# Altium schematic sheet 30.SchDoc
size 513 x 386 mm
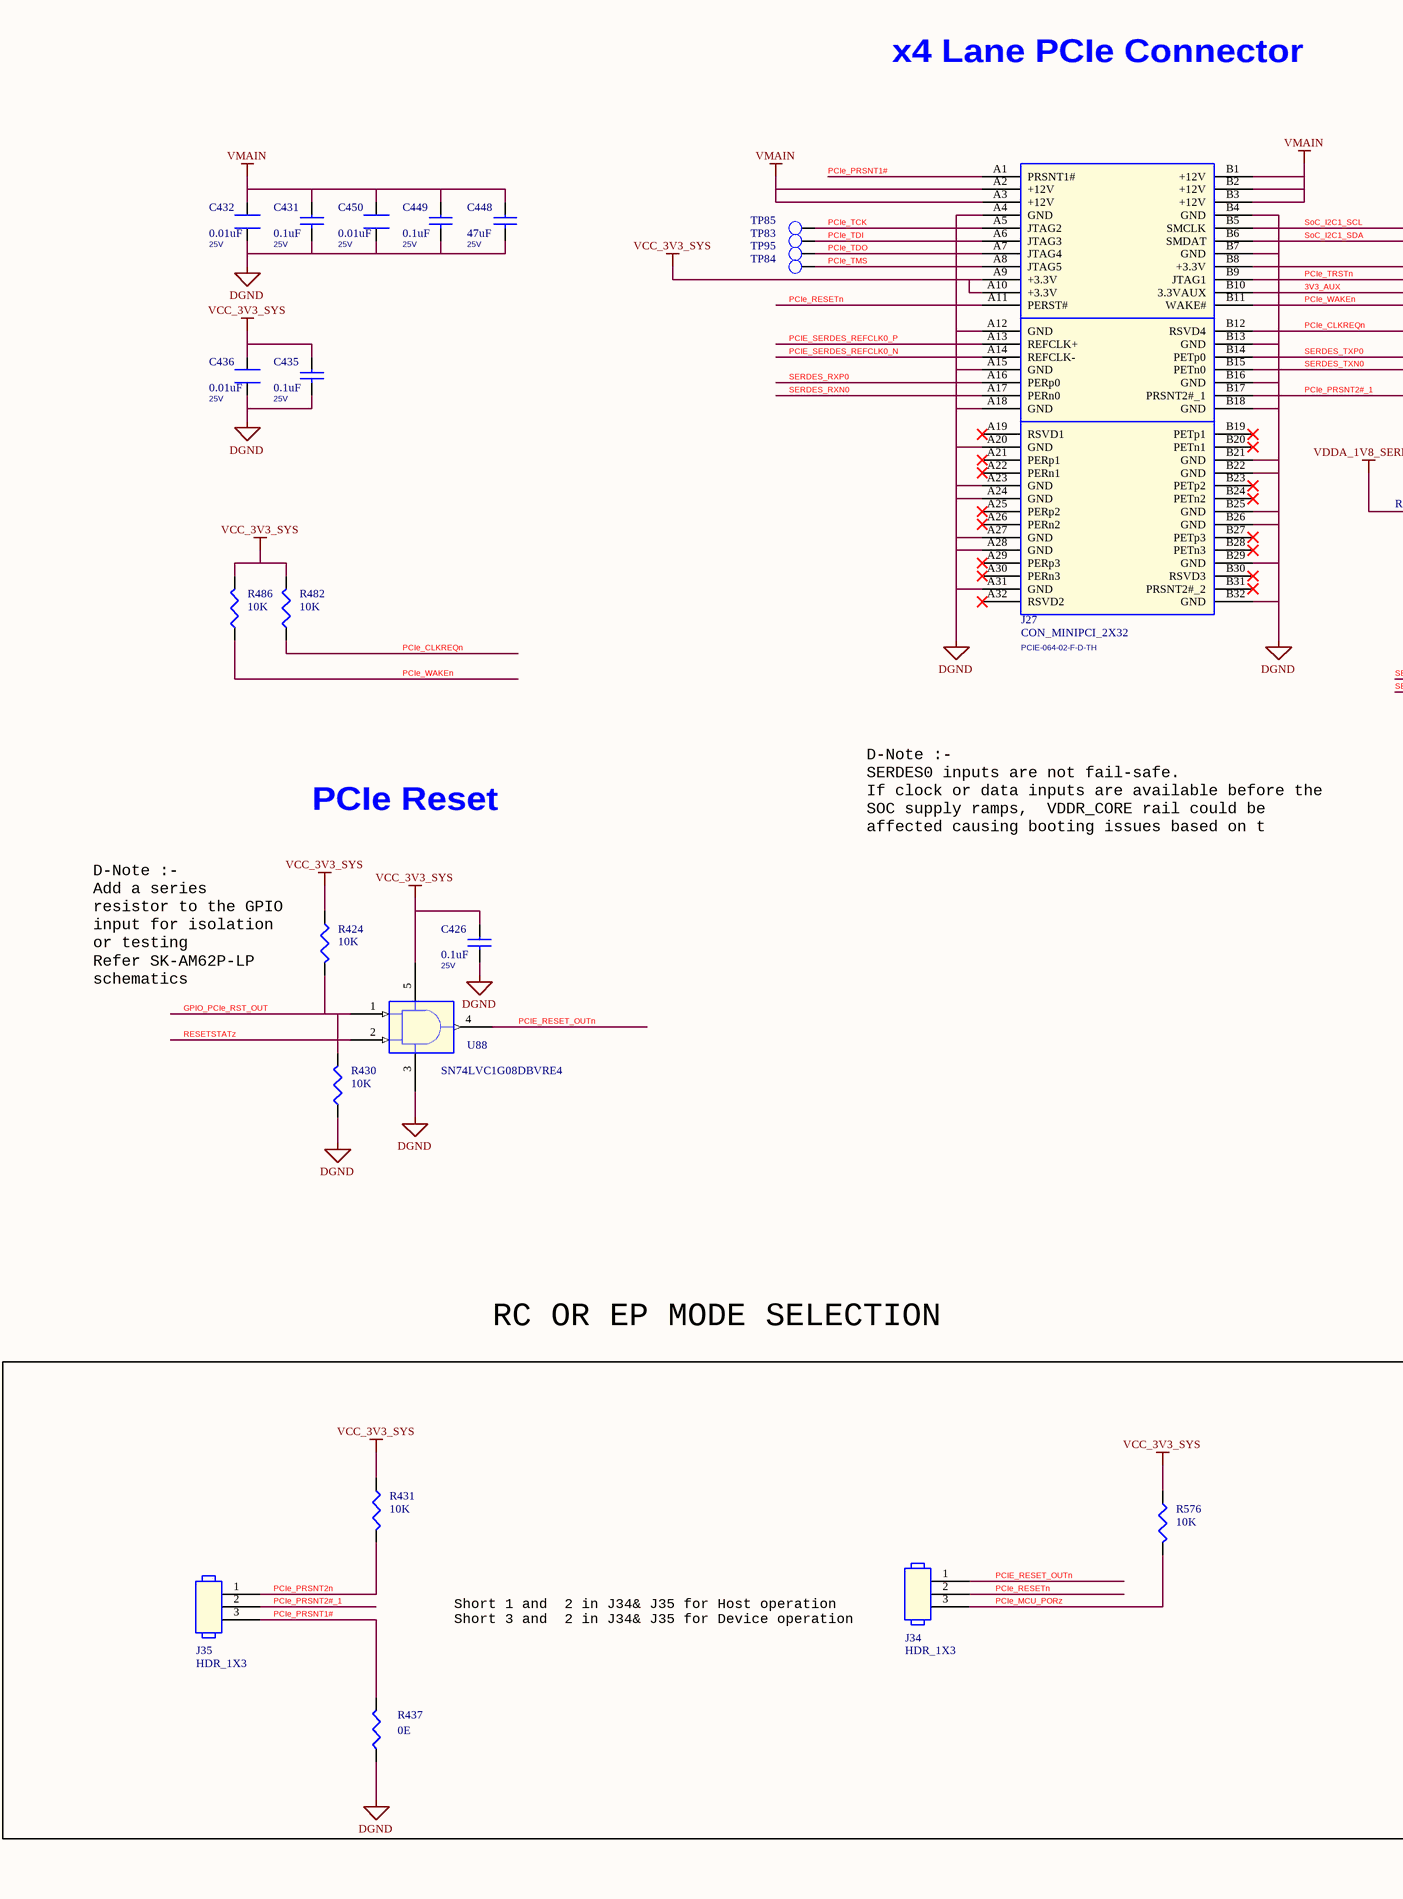
[diagram p0: 30.SchDoc, left]
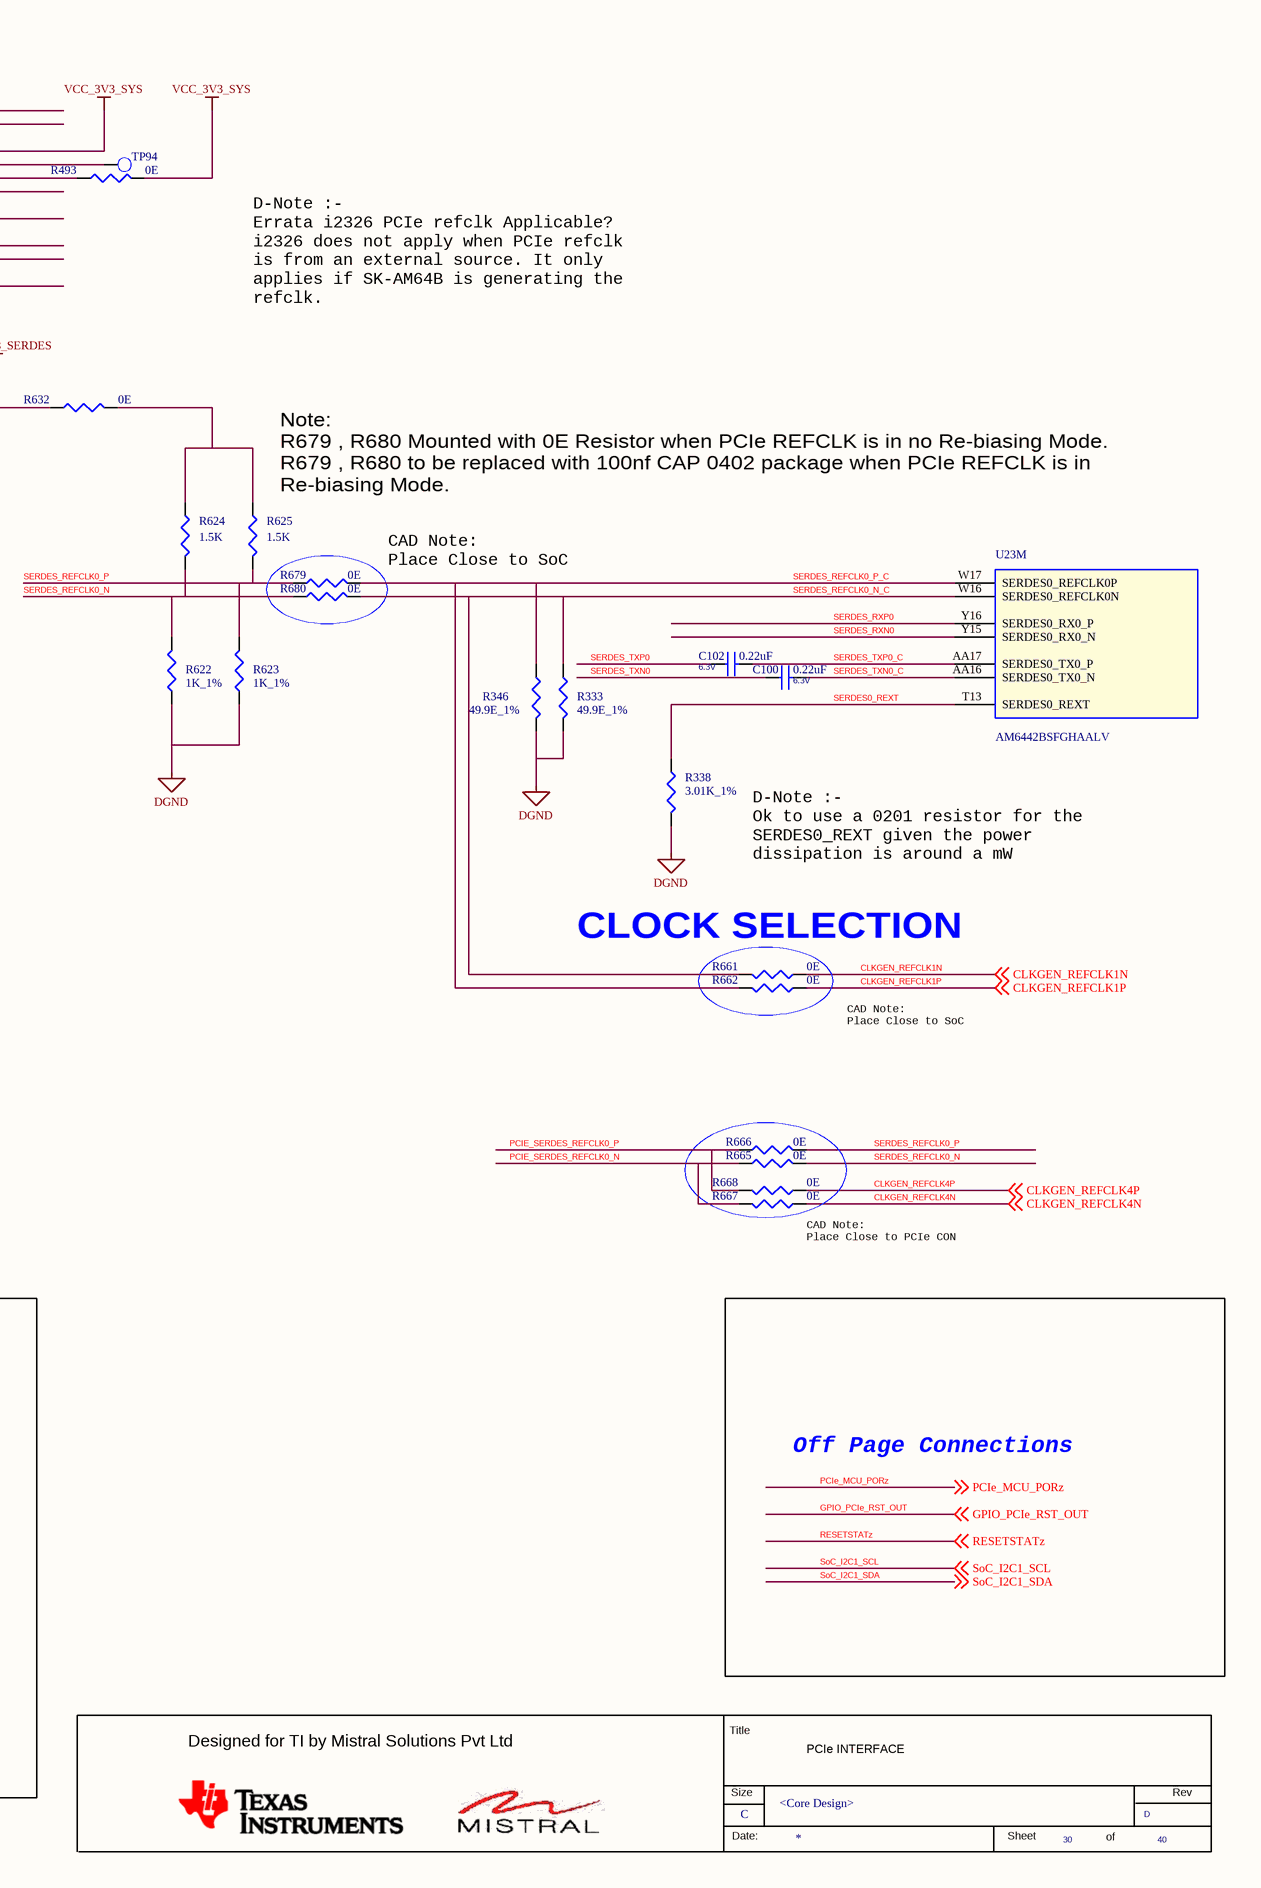
[diagram p1: 30.SchDoc, right]

## Parts
*  RevCode: D  Title: PCIe INTERFACE  Page Size: C  Page Number: 30  Page Count: 40  Variant Name: <Core Design>  (hidden comment: MISTRAL_TITLEBLK_CSIZE)  (graphical)
C100  0.22uF  Voltage: 6.3V  [CAP0201_0-5]
C102  0.22uF  Voltage: 6.3V  [CAP0201_0-5]
C426  0.1uF  Voltage: 25V  [CAP0402_0-75]
C431  0.1uF  Voltage: 25V  [CAP0402_0-75]
C432  0.01uF  Voltage: 25V  [CAP0402N]
C435  0.1uF  Voltage: 25V  [CAP0402_0-75]
C436  0.01uF  Voltage: 25V  [CAP0402N]
C448  47uF  Voltage: 25V  [CAP1206_2]
C449  0.1uF  Voltage: 25V  [CAP0402_0-75]
C450  0.01uF  Voltage: 25V  [CAP0402N]
J27  CON_MINIPCI_2X32  Mfr_part_number: PCIE-064-02-F-D-TH  [CON_MINIPCI2X32_PCIE-064-02_S_S_T_11]
J34  HDR_1X3  [HDR_3X1_100_S_T]
J35  HDR_1X3  [HDR_3X1_100_S_T]
R333  49.9E_1%  [RES0402_0-5]
R338  3.01K_1%  [RES0402_0-5]
R346  49.9E_1%  [RES0402_0-5]
R424  10K  [RES0402_0-5]
R430  10K  [RES0402_0-5]
R431  10K  [RES0402_0-5]
R437  0E  [RES0402_0-5]
R482  10K  [RES0402_0-5]
R486  10K  [RES0402_0-5]
R493  0E  [RES0402_0-5]
R576  10K  [RES0402_0-5]
R622  1K_1%  [RES0402_0-5]
R623  1K_1%  [RES0402_0-5]
R624  1.5K  [RES0402_0-5]
R625  1.5K  [RES0402_0-5]
R632  0E  [RES0402_0-5]
R661  0E  [RES0402_0-5]
R662  0E  [RES0402_0-5]
R665  0E  [RES0402_0-5]
R666  0E  [RES0402_0-5]
R667  0E  [RES0402_0-5]
R668  0E  [RES0402_0-5]
R679  0E  [RES0402_0-5]
R680  0E  [RES0402_0-5]
TP83  TP20_SMD  [TP20_SMD]  (value not drawn)
TP84  TP20_SMD  [TP20_SMD]  (value not drawn)
TP85  TP20_SMD  [TP20_SMD]  (value not drawn)
TP94  TP20_SMD  [TP20_SMD]  (value not drawn)
TP95  TP20_SMD  [TP20_SMD]  (value not drawn)
U23  AM6442BSFGHAALV  [FCBGA441_31-49_680X680_2-6]  (part M of 16)
U88  SN74LVC1G08DBVRE4  [SOT23-5]

## Nets
DGND: C426.2 C431.2 C432.2 C435.2 C436.2 C448.2 C449.2 C450.2 J27.A4(GND) J27.A12(GND) J27.A15(GND) J27.A18(GND) J27.A20(GND) J27.A23(GND) J27.A24(GND) J27.A27(GND) J27.A28(GND) J27.A31(GND) J27.B4(GND) J27.B7(GND) J27.B13(GND) J27.B16(GND) J27.B18(GND) J27.B21(GND) J27.B22(GND) J27.B25(GND) J27.B26(GND) J27.B29(GND) J27.B32(GND) R333.2 R338.2 R346.2 R430.2 R437.1 R622.1 R623.1 U88.3(GND)
VCC_3V3_SYS: C426.1 C435.1 C436.1 J27.A9(+3.3V) J27.A10(+3.3V) J27.B8(+3.3V) R424.1 R431.1 R482.2 R486.2 R493.1 R576.1 U88.5(VCC)
VDDA_1V8_SERDES: R632.2
VMAIN: C431.1 C432.1 C448.1 C449.1 C450.1 J27.A2(+12V) J27.A3(+12V) J27.B1(+12V) J27.B2(+12V) J27.B3(+12V)
3V3_AUX: J27.B10(3.3VAUX) R493.2
CLKGEN_REFCLK1N: R661.1 ; off-sheet CLKGEN_REFCLK1N
CLKGEN_REFCLK1P: R662.1 ; off-sheet CLKGEN_REFCLK1P
CLKGEN_REFCLK4N: R667.1 ; off-sheet CLKGEN_REFCLK4N
CLKGEN_REFCLK4P: R668.1 ; off-sheet CLKGEN_REFCLK4P
GPIO_PCIe_RST_OUT: R424.2 R430.1 U88.1(A) ; off-sheet GPIO_PCIe_RST_OUT
PCIe_CLKREQn: J27.B12(RSVD4) R482.1
PCIe_MCU_PORz: J34.3 R576.2 ; off-sheet PCIe_MCU_PORz
PCIe_PRSNT1#: J27.A1(PRSNT1#) J35.3 R437.2
PCIe_PRSNT2#_1: J27.B17(PRSNT2#_1) J35.2
PCIe_PRSNT2n: J35.1 R431.2
PCIE_RESET_OUTn: J34.1 U88.4(Y)
PCIe_RESETn: J27.A11(PERST#) J34.2
PCIE_SERDES_REFCLK0_N: J27.A14(REFCLK-) R665.1 R667.2
PCIE_SERDES_REFCLK0_P: J27.A13(REFCLK+) R666.1 R668.2
PCIe_TCK: J27.A5(JTAG2) TP85.1(TP)
PCIe_TDI: J27.A6(JTAG3) TP83.1(TP)
PCIe_TDO: J27.A7(JTAG4) TP95.1(TP)
PCIe_TMS: J27.A8(JTAG5) TP84.1(TP)
PCIe_TRSTn: J27.B9(JTAG1) TP94.1(TP)
PCIe_WAKEn: J27.B11(WAKE#) R486.1
RESETSTATz: U88.2(B) ; off-sheet RESETSTATz
SERDES0_REXT: R338.1 U23.T13(SERDES0_REXT)
SERDES_REFCLK0_N: R622.2 R624.2 R665.2 R680.1
SERDES_REFCLK0_N_C: R333.1 R661.2 R680.2 U23.W16(SERDES0_REFCLK0N)
SERDES_REFCLK0_P: R623.2 R625.2 R666.2 R679.1
SERDES_REFCLK0_P_C: R346.1 R662.2 R679.2 U23.W17(SERDES0_REFCLK0P)
SERDES_RXN0: J27.A17(PERn0) U23.Y15(SERDES0_RX0_N)
SERDES_RXP0: J27.A16(PERp0) U23.Y16(SERDES0_RX0_P)
SERDES_TXN0: C100.1 J27.B15(PETn0)
SERDES_TXN0_C: C100.2 U23.AA16(SERDES0_TX0_N)
SERDES_TXP0: C102.1 J27.B14(PETp0)
SERDES_TXP0_C: C102.2 U23.AA17(SERDES0_TX0_P)
SoC_I2C1_SCL: J27.B5(SMCLK) ; off-sheet SoC_I2C1_SCL
SoC_I2C1_SDA: J27.B6(SMDAT) ; off-sheet SoC_I2C1_SDA
NetR624_1: R624.1 R625.1 R632.1

Not connected (* = marked no-connect by the designer): J27 A19(RSVD1)* A21(PERp1)* A22(PERn1)* A25(PERp2)* A26(PERn2)* A29(PERp3)* A30(PERn3)* A32(RSVD2)* B19(PETp1)* B20(PETn1)* B23(PETp2)* B24(PETn2)* B27(PETp3)* B28(PETn3)* B30(RSVD3)* B31(PRSNT2#_2)*

## Notes on the sheet
- x4 Lane PCIe Connector
- D-Note :-
  Errata i2326 PCIe refclk Applicable?
  i2326 does not apply when PCIe refclk
  is from an external source. It only
  applies if SK-AM64B is generating the
  refclk.
- (near R625) Note:
  R679 , R680 Mounted with 0E Resistor when PCIe REFCLK is in no Re-biasing Mode.
  R679 , R680 to be replaced with 100nf CAP 0402 package when PCIe REFCLK is in
  Re-biasing Mode.
- CAD Note:
  Place Close to SoC
- D-Note :-
  SERDES0 inputs are not fail-safe.
  If clock or data inputs are available before the
  SOC supply ramps,  VDDR_CORE rail could be
  affected causing booting issues based on t
- (near R424) D-Note :-
  Add a series
  resistor to the GPIO
  input for isolation
  or testing
  Refer SK-AM62P-LP
  schematics
- PCIe Reset
- D-Note :-
  Ok to use a 0201 resistor for the
  SERDES0_REXT given the power
  dissipation is around a mW
- CLOCK SELECTION
- CAD Note:
  Place Close to PCIe CON
- RC OR EP MODE SELECTION
- Off Page Connections
- (near J34) Short 1 and  2 in J34& J35 for Host operation
  Short 3 and  2 in J34& J35 for Device operation
- (in symbol MISTRAL_TITLEBLK_CSIZE) Title; Designed for TI by Mistral Solutions Pvt Ltd; Size; Rev; Date:; Sheet; of

## Library data of the parts
* = MISTRAL_TITLEBLK_CSIZE: Issue: 1.0; Doc: PROC067; Page Create Date: March  8, 1995; Page Modify Date: *
C100 C102 = CAP_Dup3: CAP CERAMIC 0.22uF 6.3V 10% X6S 0201; Mistral Part No: 120021060017-R; Mfr_name: MURATA; Mfr_part_number: GRM033C80J224KE90D; Part_type: CAPACITORS\CERAMIC; Project: TI_J7AEP_EVM; Wattage: NA; Customs_HS_Code: 85322990; Custom_Duty: 15%; Library Ref: CAP; Tolerance: 10%; Package: 0201; Distributor_name: DIGIKEY; Distributor_part_number: 490-10392-1-ND; Height: 0.33MM; Weight: 0.33mg; Temperature: -55癈+105癈; Datasheet: Y:\MIS_DATABASE\DATASHEETS\CAPACITORS\GRM033C80J224KE90.PDF; Crtd /date: MANIRAJA/290621; Chkd/date: ALVY/290621; MECHANICAL 3D STEP FILE: CAP0201_0-5; Footprint Ref: CAP0201_0-5; Library Path: Y:\MIS_DATABASE\Library\ALTIUM_TOOL\SCHEMATICS_PARTS\MS_DISCRETE_Library.schlib; Footprint Path: Y:\MIS_DATABASE\Library\ALTIUM_TOOL\PCB_FOOTPRINTS\Altium_Footprint_Lib.PcbLib; PCB Footprint: CAP0201_0-5
C426 = CAP_Dup3: CAP CERAMIC 0.1uF 25V 20% X5R 0402; Alt_Mfr_part_number: CC0402KRX5R8BB104; Mistral Part No: 120020080003-R; Mfr_name: WURTH ELECTRONICS; Mfr_part_number: 885012105018; Part_type: CAPACITORS\CERAMIC; Alt_Mfr_name: YAGEO AMERICA; Project: AM64x_EVM_BRD; Wattage: NA; Customs_HS_Code: 85322990; Custom_Duty: 15%; Tolerance: 20%; Package: 0402; Distributor_name: DIGIKEY; Distributor_part_number: 732-7495-1-ND; Height: 0.55MM; Weight: 0.65mg; Temperature: -55癈+85癈; Datasheet: Y:\MIS_DATABASE\DATASHEETS\CAPACITORS\885012105018.PDF; Crtd /date: ALVY/170820; Chkd/date: MANIRAJA/170820; MECHANICAL 3D STEP FILE: CAP0402_0-75; Library Ref: CAP; Footprint Ref: CAP0402_0-75; Library Path: Y:\MIS_DATABASE\Library\ALTIUM_TOOL\SCHEMATICS_PARTS\MS_DISCRETE_Library.schlib; Footprint Path: Y:\MIS_DATABASE\Library\ALTIUM_TOOL\PCB_FOOTPRINTS\Altium_Footprint_Lib.PcbLib; PCB Footprint: CAP0402_0-75
C431 C435 = CAP_Dup3: CAP CERAMIC 0.1uF 25V 20% X5R 0402; Alt_Mfr_name: YAGEO AMERICA; Part_type: CAPACITORS\CERAMIC; Mfr_part_number: 885012105018; Mfr_name: WURTH ELECTRONICS; Mistral Part No: 120020080003-R; Alt_Mfr_part_number: CC0402KRX5R8BB104; Custom_Duty: 15%; Customs_HS_Code: 85322990; Wattage: NA; Project: AM64x_EVM_BRD; Footprint Path: Y:\MIS_DATABASE\Library\ALTIUM_TOOL\PCB_FOOTPRINTS\Altium_Footprint_Lib.PcbLib; Library Path: Y:\MIS_DATABASE\Library\ALTIUM_TOOL\SCHEMATICS_PARTS\MS_DISCRETE_Library.schlib; Footprint Ref: CAP0402_0-75; Library Ref: CAP; MECHANICAL 3D STEP FILE: CAP0402_0-75; Chkd/date: MANIRAJA/170820; Crtd /date: ALVY/170820; Datasheet: Y:\MIS_DATABASE\DATASHEETS\CAPACITORS\885012105018.PDF; Temperature: -55癈+85癈; Weight: 0.65mg; Height: 0.55MM; Distributor_part_number: 732-7495-1-ND; Distributor_name: DIGIKEY; Package: 0402; Tolerance: 20%; PCB Footprint: CAP0402_0-75
C432 C436 = CAP_Dup2: CAP CERAMIC 0.01uF 25V 10% X7R 0402; Part_type: CAPACITORS\CERAMIC; Mfr_part_number: 885012205050; Mfr_name: WURTH ELECTRONICS; Mistral Part No: 120011090040-R; MECHANICAL 3D STEP FILE: CAP0402_0-75; Wattage: NA; Custom_Duty: 15%; Customs_HS_Code: 85322990; Project: AM64x_EVM_BRD; Footprint Path: Y:\MIS_DATABASE\Library\ALTIUM_TOOL\PCB_FOOTPRINTS\Altium_Footprint_Lib.PcbLib; Library Path: Y:\MIS_DATABASE\Library\ALTIUM_TOOL\SCHEMATICS_PARTS\MS_DISCRETE_Library.schlib; Footprint Ref: CAP0402_0-75; Temperature: -55癈+125癈; Weight: 0.65mg; Chkd/date: MANIRAJA/170820; Crtd /date: ALVY/170820; Datasheet: Y:\MIS_DATABASE\DATASHEETS\CAPACITORS\885012205050.PDF; Height: 0.55MM; Distributor_part_number: 732-7545-1-ND; Distributor_name: DIGIKEY; Package: 0402; Tolerance: 10%; Library Ref: CAP; PCB Footprint: CAP0402_0-75
C448 = CAP_Dup3: CAP CERAMIC 47uF 25V 20% X5R 1206; Part_type: CAPACITORS\CERAMIC; Mfr_part_number: GRM31CR61E476ME44L; Mfr_name: MURATA; Mistral Part No: 120013050002-R; Custom_Duty: 15%; Customs_HS_Code: 85322990; Wattage: NA; Project: TI_MAXIE_CPB; Footprint Path: Y:\MIS_DATABASE\Library\ALTIUM_TOOL\PCB_FOOTPRINTS\Altium_Footprint_Lib.PcbLib; Library Path: Y:\MIS_DATABASE\Library\ALTIUM_TOOL\SCHEMATICS_PARTS\MS_DISCRETE_Library.schlib; Footprint Ref: CAP1206_2; Library Ref: CAP; MECHANICAL 3D STEP FILE: CAP1206_2; Chkd/date: MANIRAJA/230118; Crtd /date: MANIRAJA/230118; Datasheet: Y:\MIS_DATABASE\DATASHEETS\CAPACITORS\MURATA-GXX-SER_NOV17.PDF; Temperature: -55癈+85癈; Weight: 40mg; Height: 1.80MM; Distributor_part_number: 490-16268-1-ND; Distributor_name: DIGIKEY; Package: 1206; Tolerance: 20%; PCB Footprint: CAP1206_2
C449 = CAP_Dup3: CAP CERAMIC 0.1uF 25V 20% X5R 0402; Alt_Mfr_name: YAGEO AMERICA; Mistral Part No: 120020080003-R; Mfr_name: WURTH ELECTRONICS; Mfr_part_number: 885012105018; Part_type: CAPACITORS\CERAMIC; Alt_Mfr_part_number: CC0402KRX5R8BB104; Project: AM64x_EVM_BRD; Wattage: NA; Customs_HS_Code: 85322990; Custom_Duty: 15%; Footprint Path: Y:\MIS_DATABASE\Library\ALTIUM_TOOL\PCB_FOOTPRINTS\Altium_Footprint_Lib.PcbLib; Library Path: Y:\MIS_DATABASE\Library\ALTIUM_TOOL\SCHEMATICS_PARTS\MS_DISCRETE_Library.schlib; Footprint Ref: CAP0402_0-75; Library Ref: CAP; Tolerance: 20%; Package: 0402; Distributor_name: DIGIKEY; Distributor_part_number: 732-7495-1-ND; Height: 0.55MM; Weight: 0.65mg; Temperature: -55癈+85癈; Datasheet: Y:\MIS_DATABASE\DATASHEETS\CAPACITORS\885012105018.PDF; Crtd /date: ALVY/170820; Chkd/date: MANIRAJA/170820; MECHANICAL 3D STEP FILE: CAP0402_0-75; PCB Footprint: CAP0402_0-75
C450 = CAP_Dup2: CAP CERAMIC 0.01uF 25V 10% X7R 0402; Mistral Part No: 120011090040-R; Mfr_name: WURTH ELECTRONICS; Mfr_part_number: 885012205050; Part_type: CAPACITORS\CERAMIC; Project: AM64x_EVM_BRD; Customs_HS_Code: 85322990; Custom_Duty: 15%; Wattage: NA; MECHANICAL 3D STEP FILE: CAP0402_0-75; Library Ref: CAP; Tolerance: 10%; Package: 0402; Distributor_name: DIGIKEY; Distributor_part_number: 732-7545-1-ND; Height: 0.55MM; Datasheet: Y:\MIS_DATABASE\DATASHEETS\CAPACITORS\885012205050.PDF; Crtd /date: ALVY/170820; Chkd/date: MANIRAJA/170820; Weight: 0.65mg; Temperature: -55癈+125癈; Footprint Ref: CAP0402_0-75; Library Path: Y:\MIS_DATABASE\Library\ALTIUM_TOOL\SCHEMATICS_PARTS\MS_DISCRETE_Library.schlib; Footprint Path: Y:\MIS_DATABASE\Library\ALTIUM_TOOL\PCB_FOOTPRINTS\Altium_Footprint_Lib.PcbLib; PCB Footprint: CAP0402_0-75
J27 = CON_MINIPCI_32X2: CON MINIPCI 2X32 1.00MM PITCH SOCKET ST TH; Mistral Part No: 150017100015-R; Mfr_name: SAMTEC; Part_type: CONNECTOR\PCI; Project: TI_SVB_MAXWELL_SPM; Tolerance: NA; Customs_HS_Code: 85369090; Custom_Duty: 24%; TEXT: PCIe x2; Voltage: NA; Wattage: NA; Package: THRU-HOLE; Distributor_name: DIGIKEY; Distributor_part_number: SAM9742-ND; Height: 11.00MM; Weight: NA; Temperature: -55癈+125癈; Datasheet: Y:\MIS_DATABASE\DATASHEETS\CONNECTORS\SAMTEC-PCIE-TH.PDF; Crtd /date: MANIRAJA/101017; Chkd/date: MANIRAJA/101017; MECHANICAL 3D STEP FILE: CON_MINIPCI2X32_PCIE-064-02_S_S_T_11; Library Ref: CON_MINIPCI_32X2; PCB Footprint: CON_MINIPCI2X32_PCIE-064-02_S_S_T_11
J34 J35 = HEADER_3X1: HDR 1X3 2.54MM PITCH ST TH; Part_type: CONNECTOR\HEADERS; Mfr_part_number: 68001-403HLF; Mfr_name: FCI; Mistral Part No: 150016060025-R; TEXT1: INT; Custom_Duty: 15%; Customs_HS_Code: 85322990; Wattage: NA; Project: IKEYP; TEXT: REST; TEXT2: EXT; Library Ref: HEADER_3X1; Chkd/date: VASANTHA/290616; Crtd /date: VASANTHA/290616; Datasheet: Y:\MIS_DATABASE\DATASHEETS\CONNECTORS\68000.PDF; Temperature: -40癈+105癈; Weight: NA; Height: 8.58MM; Distributor_part_number: 609-3471-ND; Distributor_name: DIGIKEY; Package: THRU-HOLE; Voltage: NA; Tolerance: NA; PCB Footprint: HDR_3X1_100_S_T
R333 R346 = RESISTOR: RES 49.9E 1/16W 1% 0402; Mistral Part No: 110009030846-R; Mfr_name: VISHAY; Mfr_part_number: CRCW040249R9FKEDC; Part_type: RESISTORS\FIXED; Project: RFSU_RFTJ_CARD; Voltage: NA; Customs_HS_Code: 85332119; Custom_Duty: 15%; Footprint Ref: RES0402_0-5; Tolerance: 1%; Wattage: 1/16W; Package: 0402; Distributor_name: DIGIKEY; Distributor_part_number: 541-3967-1-ND; Library Ref: RESISTOR; Height: 0.35MM; Weight: 0.65mg; Temperature: -55癈+155癈; Datasheet: Y:\MIS_DATABASE\DATASHEETS\RESISTORS\CRCW_C-SER.PDF; Crtd /date: MANIRAJA/210519; Chkd/date: MANIRAJA/210519; MECHANICAL 3D STEP FILE: RES0402_0-5; Library Path: Y:\MIS_DATABASE\Library\ALTIUM_TOOL\SCHEMATICS_PARTS\MS_DISCRETE_Library.schlib; Footprint Path: Y:\MIS_DATABASE\Library\ALTIUM_TOOL\PCB_FOOTPRINTS\Altium_Footprint_Lib.PcbLib; PCB Footprint: RES0402_0-5
R338 = RESISTOR_Dup1: RES 3.01K 1/16W 1% 0402; Part_type: RESISTORS\FIXED; Mfr_part_number: CRCW04023K01FKED; Mfr_name: VISHAY; Mistral Part No: 110020060037-R; Custom_Duty: 15%; Customs_HS_Code: 85332119; Voltage: NA; Project: AM64x-GP_EVM BRD; Footprint Path: Y:\MIS_DATABASE\Library\ALTIUM_TOOL\PCB_FOOTPRINTS\Altium_Footprint_Lib.PcbLib; Library Path: Y:\MIS_DATABASE\Library\ALTIUM_TOOL\SCHEMATICS_PARTS\MS_DISCRETE_Library.schlib; MECHANICAL 3D STEP FILE: RES0402_0-5; Chkd/date: MANIRAJA/150620; Crtd /date: ALVY/120620; Datasheet: Y:\MIS_DATABASE\DATASHEETS\RESISTORS\CRCW0603.PDF; Temperature: -55癈+155癈; Weight: 0.65mg; Height: 0.40MM; Library Ref: RESISTOR; Distributor_part_number: 541-3.01KLCT-ND; Distributor_name: DIGIKEY; Package: 0402; Wattage: 1/16W; Tolerance: 1%; Footprint Ref: RES0402_0-5; PCB Footprint: RES0402_0-5
R424 R431 R576 = RESISTOR_Dup6: RES 10K 1/16W 5% 0402; Mistral Part No: 110011060021-R; Mfr_name: YAGEO AMERICA; Mfr_part_number: RC0402JR-0710KL; Part_type: RESISTORS\FIXED; Project: HSE; Voltage: NA; Customs_HS_Code: 85332119; Custom_Duty: 15%; Footprint Path: Y:\MIS_DATABASE\Library\ALTIUM_TOOL\PCB_FOOTPRINTS\Altium_Footprint_Lib.PcbLib; Library Path: Y:\MIS_DATABASE\Library\ALTIUM_TOOL\SCHEMATICS_PARTS\MS_DISCRETE_Library.schlib; Footprint Ref: RES0402_0-5; Library Ref: RESISTOR; Tolerance: 5%; Wattage: 1/16W; Package: 0402; Distributor_name: DIGIKEY; Distributor_part_number: 311-10KJRCT-ND; Height: 0.40MM; Weight: 0.65mg; Temperature: -55癈+155癈; Datasheet: Y:\MIS_DATABASE\DATASHEETS\RESISTORS\RCXXXXL-SER_MAR18.PDF; Crtd /date: MAZHAR/230805; Chkd/date: VASANTHA/061216; MECHANICAL 3D STEP FILE: RES0402_0-5; PCB Footprint: RES0402_0-5
R430 R482 R486 = RESISTOR_Dup6: RES 10K 1/16W 5% 0402; Part_type: RESISTORS\FIXED; Mfr_part_number: RC0402JR-0710KL; Mfr_name: YAGEO AMERICA; Mistral Part No: 110011060021-R; Custom_Duty: 15%; Customs_HS_Code: 85332119; Voltage: NA; Project: HSE; PCB Footprint: RES0402_0-5; Footprint Path: Y:\MIS_DATABASE\Library\ALTIUM_TOOL\PCB_FOOTPRINTS\Altium_Footprint_Lib.PcbLib; Library Path: Y:\MIS_DATABASE\Library\ALTIUM_TOOL\SCHEMATICS_PARTS\MS_DISCRETE_Library.schlib; Footprint Ref: RES0402_0-5; Library Ref: RESISTOR; MECHANICAL 3D STEP FILE: RES0402_0-5; Chkd/date: VASANTHA/061216; Crtd /date: MAZHAR/230805; Datasheet: Y:\MIS_DATABASE\DATASHEETS\RESISTORS\RCXXXXL-SER_MAR18.PDF; Temperature: -55癈+155癈; Weight: 0.65mg; Height: 0.40MM; Distributor_part_number: 311-10KJRCT-ND; Distributor_name: DIGIKEY; Package: 0402; Wattage: 1/16W; Tolerance: 5%
R437 = RESISTOR_Dup6: RES 0E 1/16W JUMPER 0402; Mistral Part No: 110010080019-R; Mfr_name: VISHAY; Mfr_part_number: CRCW04020000Z0ED; Part_type: RESISTORS\FIXED; Project: PB_BUGBASE; Tolerance: NA; Customs_HS_Code: 85332119; Custom_Duty: 15%; Voltage: NA; Wattage: 1/16W; Package: 0402; Distributor_name: DIGIKEY; Distributor_part_number: 541-0.0JCT-ND; Height: 0.40MM; Weight: 0.65mg; Temperature: -55癈+155癈; Datasheet: Y:\MIS_DATABASE\DATASHEETS\RESISTORS\CRCW0603.PDF; Crtd /date: MUDDU/190810; Chkd/date: VASANTHA/201216; MECHANICAL 3D STEP FILE: RES0402_0-5; Library Ref: RESISTOR; Footprint Ref: RES0402_0-5; Library Path: Y:\MIS_DATABASE\Library\ALTIUM_TOOL\SCHEMATICS_PARTS\MS_DISCRETE_Library.schlib; Footprint Path: Y:\MIS_DATABASE\Library\ALTIUM_TOOL\PCB_FOOTPRINTS\Altium_Footprint_Lib.PcbLib; PCB Footprint: RES0402_0-5
R493 R632 R661 R667 R668 = RESISTOR_Dup5: RES 0E 1/16W JUMPER 0402; Mistral Part No: 110010080019-R; Mfr_name: VISHAY; Mfr_part_number: CRCW04020000Z0ED; Part_type: RESISTORS\FIXED; Project: PB_BUGBASE; Tolerance: NA; Customs_HS_Code: 85332119; Custom_Duty: 15%; MECHANICAL 3D STEP FILE: RES0402_0-5; Voltage: NA; Wattage: 1/16W; Package: 0402; Distributor_name: DIGIKEY; Distributor_part_number: 541-0.0JCT-ND; Height: 0.40MM; Weight: 0.65mg; Temperature: -55癈+155癈; Datasheet: Y:\MIS_DATABASE\DATASHEETS\RESISTORS\CRCW0603.PDF; Crtd /date: MUDDU/190810; Chkd/date: VASANTHA/201216; Library Ref: RESISTOR; Footprint Ref: RES0402_0-5; Library Path: Y:\MIS_DATABASE\Library\ALTIUM_TOOL\SCHEMATICS_PARTS\MS_DISCRETE_Library.schlib; Footprint Path: Y:\MIS_DATABASE\Library\ALTIUM_TOOL\PCB_FOOTPRINTS\Altium_Footprint_Lib.PcbLib; PCB Footprint: RES0402_0-5
R622 R623 = RESISTOR_Dup5: RES 1K 1/10W 1% 0402; Part_type: RESISTORS\FIXED; Mfr_part_number: ERJ-2RKF1001X; Mfr_name: PANASONIC-ECG; Mistral Part No: 110009030411-R; Custom_Duty: 15%; Customs_HS_Code: 85332119; Voltage: NA; Project: VOCERA; Chkd/date: VASANTHA/281216; Crtd /date: MAZHAR/150506; Datasheet: Y:\MIS_DATABASE\DATASHEETS\RESISTORS\PAN-ERJSER_NOV17.PDF; Temperature: -55癈+155癈; Weight: 0.8mg; Height: 0.40MM; Distributor_part_number: P1.00KLCT-ND; Distributor_name: DIGIKEY; Package: 0402; Wattage: 1/10W; Tolerance: 1%; Library Ref: RESISTOR; Footprint Ref: RES0402_0-5; MECHANICAL 3D STEP FILE: RES0402_0-5; Library Path: Y:\MIS_DATABASE\Library\ALTIUM_TOOL\SCHEMATICS_PARTS\MS_DISCRETE_Library.schlib; Footprint Path: Y:\MIS_DATABASE\Library\ALTIUM_TOOL\PCB_FOOTPRINTS\Altium_Footprint_Lib.PcbLib; PCB Footprint: RES0402_0-5
R624 = RESISTOR_Dup6: RES 1.5K 1/16W 5% 0402; Mistral Part No: 110010120012-R; Mfr_name: YAGEO AMERICA; Mfr_part_number: RC0402JR-071K5L; Part_type: RESISTORS\FIXED; Project: TE4; Voltage: NA; Customs_HS_Code: 85332119; Custom_Duty: 15%; Library Path: Y:\MIS_DATABASE\Library\ALTIUM_TOOL\SCHEMATICS_PARTS\MS_DISCRETE_Library.schlib; Footprint Ref: RES0402_0-5; Tolerance: 5%; Wattage: 1/16W; Package: 0402; Distributor_name: DIGIKEY; Distributor_part_number: 311-1.5KJRCT-ND; Height: 0.40MM; Weight: 0.65mg; Temperature: -55癈+155癈; Datasheet: Y:\MIS_DATABASE\DATASHEETS\RESISTORS\RCXXXXL-SER_MAR18.PDF; Crtd /date: BAVISH/021210; Chkd/date: MANIRAJA/310718; MECHANICAL 3D STEP FILE: RES0402_0-5; Footprint Path: Y:\MIS_DATABASE\Library\ALTIUM_TOOL\PCB_FOOTPRINTS\Altium_Footprint_Lib.PcbLib; Library Ref: RESISTOR; PCB Footprint: RES0402_0-5
R625 = RESISTOR_Dup6: RES 1.5K 1/16W 5% 0402; Part_type: RESISTORS\FIXED; Mfr_part_number: RC0402JR-071K5L; Mfr_name: YAGEO AMERICA; Mistral Part No: 110010120012-R; Custom_Duty: 15%; Customs_HS_Code: 85332119; Voltage: NA; Project: TE4; Library Ref: RESISTOR; Footprint Path: Y:\MIS_DATABASE\Library\ALTIUM_TOOL\PCB_FOOTPRINTS\Altium_Footprint_Lib.PcbLib; MECHANICAL 3D STEP FILE: RES0402_0-5; Chkd/date: MANIRAJA/310718; Crtd /date: BAVISH/021210; Datasheet: Y:\MIS_DATABASE\DATASHEETS\RESISTORS\RCXXXXL-SER_MAR18.PDF; Temperature: -55癈+155癈; Weight: 0.65mg; Height: 0.40MM; Distributor_part_number: 311-1.5KJRCT-ND; Distributor_name: DIGIKEY; Package: 0402; Wattage: 1/16W; Tolerance: 5%; Footprint Ref: RES0402_0-5; Library Path: Y:\MIS_DATABASE\Library\ALTIUM_TOOL\SCHEMATICS_PARTS\MS_DISCRETE_Library.schlib; PCB Footprint: RES0402_0-5
R662 R665 R666 R679 R680 = RESISTOR_Dup5: RES 0E 1/16W JUMPER 0402; Part_type: RESISTORS\FIXED; Mfr_part_number: CRCW04020000Z0ED; Mfr_name: VISHAY; Mistral Part No: 110010080019-R; Custom_Duty: 15%; Customs_HS_Code: 85332119; Voltage: NA; Project: PB_BUGBASE; Footprint Path: Y:\MIS_DATABASE\Library\ALTIUM_TOOL\PCB_FOOTPRINTS\Altium_Footprint_Lib.PcbLib; Library Path: Y:\MIS_DATABASE\Library\ALTIUM_TOOL\SCHEMATICS_PARTS\MS_DISCRETE_Library.schlib; Footprint Ref: RES0402_0-5; Library Ref: RESISTOR; MECHANICAL 3D STEP FILE: RES0402_0-5; Chkd/date: VASANTHA/201216; Crtd /date: MUDDU/190810; Datasheet: Y:\MIS_DATABASE\DATASHEETS\RESISTORS\CRCW0603.PDF; Temperature: -55癈+155癈; Weight: 0.65mg; Height: 0.40MM; Distributor_part_number: 541-0.0JCT-ND; Distributor_name: DIGIKEY; Package: 0402; Wattage: 1/16W; Tolerance: NA; PCB Footprint: RES0402_0-5
TP83-TP85 TP95 = TESTPOINT: TESTPOINT CIR 20 SMD; Mistral Part No: NA; Mfr_name: LOCAL; Project: BT MODULE_CSRBC04; Footprint Ref: TP20_SMD; Library Ref: TESTPOINT; Mfr_part_number: TP20_SMD; Part_type: TESTPOINT; Package: SMD; Distributor_name: NA; Distributor_part_number: NA; Height: NA; Crtd /date: MAZHAR/171006; Chkd/date: SHREESHAIL/171006; Library Path: Y:\MIS_DATABASE\Library\ALTIUM_TOOL\SCHEMATICS_PARTS\MS_DISCRETE_Library.schlib; Footprint Path: Y:\MIS_DATABASE\Library\ALTIUM_TOOL\PCB_FOOTPRINTS\Altium_Footprint_Lib.PcbLib; Tolerance: NA; Voltage: NA; Wattage: NA; Weight: NA; Temperature: NA; Datasheet: NA; MECHANICAL 3D STEP FILE: NA; RoHS: NA; Customs_HS_Code: NA; Custom_Duty: NA; PCB Footprint: TP20_SMD
TP94 = TESTPOINT: TESTPOINT CIR 20 SMD; Mfr_name: LOCAL; Custom_Duty: NA; Project: BT MODULE_CSRBC04; PCB Footprint: TP20_SMD; Customs_HS_Code: NA; RoHS: NA; MECHANICAL 3D STEP FILE: NA; Datasheet: NA; Temperature: NA; Weight: NA; Wattage: NA; Voltage: NA; Tolerance: NA; Mistral Part No: NA; Mfr_part_number: TP20_SMD; Part_type: TESTPOINT; Package: SMD; Distributor_name: NA; Distributor_part_number: NA; Height: NA; Crtd /date: MAZHAR/171006; Chkd/date: SHREESHAIL/171006; Library Path: Y:\MIS_DATABASE\Library\ALTIUM_TOOL\SCHEMATICS_PARTS\MS_DISCRETE_Library.schlib; Footprint Path: Y:\MIS_DATABASE\Library\ALTIUM_TOOL\PCB_FOOTPRINTS\Altium_Footprint_Lib.PcbLib; Library Ref: TESTPOINT; Footprint Ref: TP20_SMD
U23 = XAM6442BSFGGAALV_BGA441: IC AM64x SoC MICROPROCESSOR BGA441; Part_type: ICS\DIGITAL\MICROPROCESSOR; Mfr_name: TEXAS INSTRUMENTS; Mistral Part No: 141220080002; Custom_Duty: 15%; Customs_HS_Code: 85423100; Wattage: NA; Project: AM64x-GP_EVM BRD; PCB Footprint: FCBGA441_31-49_680X680_2-6; Footprint Path: Y:\MIS_DATABASE\Library\ALTIUM_TOOL\PCB_FOOTPRINTS\Altium_Footprint_Lib.PcbLib; Library Path: Y:\MIS_DATABASE\Library\ALTIUM_TOOL\SCHEMATICS_PARTS\MS_MICROPROCESSOR_Library.schlib; MECHANICAL 3D STEP FILE: FCBGA441_31-49_680X680_2-6; RoHS: NA; Chkd/date: ALVY/300322; Crtd /date: ALVY/300322; Datasheet: Y:\MIS_DATABASE\DATASHEETS\ICS\DIGITAL\MICROCONTROLLER\AM64-SoC_SVB.PDF; Temperature: NA; Weight: NA; Height: 2.57MM; Library Ref: XAM6442BSFGGAALV_BGA441; Distributor_part_number: NA; Distributor_name: NA; Package: BGA441; Voltage: NA; Tolerance: NA; Mfr_part_number: AM6442BSFGHAALV; Footprint Ref: FCBGA441_31-49_680X680_2-6
U88 = SN74LVC1G08DBVRE4_SOT23-5_Dup1: IC SINGLE 2-INPUT POSITIVE AND GATE SOT23-5; Mistral Part No: 141009060026-R; Mfr_name: TEXAS INSTRUMENTS; Part_type: ICS\DIGITAL\GATES; Project: KHAN_MAIN; Customs_HS_Code: 85423100; Custom_Duty: 15%; Mfr_part_number: SN74LVC1G08DBVRE4; Package: SOT23-5; Distributor_name: DIGIKEY; Distributor_part_number: SN74LVC1G08DBVRE4-ND; Height: 1.45MM; Temperature: -40癈+85癈; Datasheet: Y:\MIS_DATABASE\DATASHEETS\ICS\DIGITAL\GATES\SN74LVC1G08.PDF; Crtd /date: USMAN/151008; Chkd/date: SUHAS/221010; RoHS: Sb/ Br FREE; Library Ref: SN74LVC1G08DBVRE4_SOT23-5; PCB Footprint: SOT23-5